# EAGLE design AmbientLight-2 (EAGLE 7.2.0)
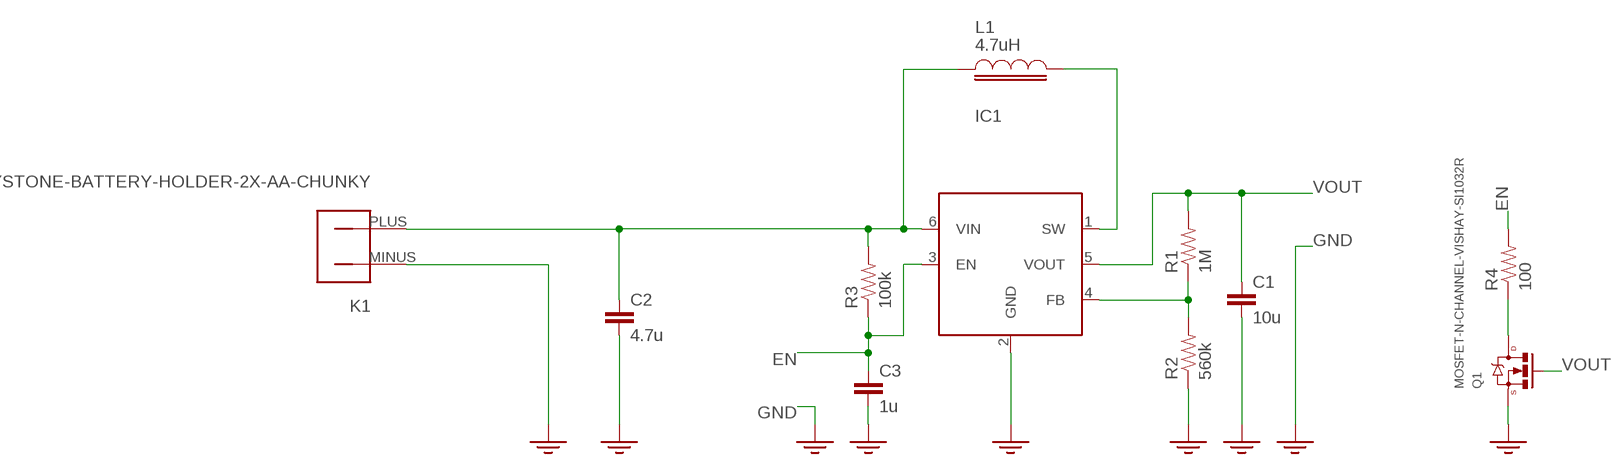
[diagram p0: schematic, sheet 1]

## Parts
C1  10u  CAP-0805-WIDE  [0805-WIDE]
C2  4.7u  CAP-0603-MIN  [0603-MIN]
C3  1u  CAP-0603-MIN  [0603-MIN]
IC1  SWITCHING-REGULATOR-VARIABLE-BOOST-MCP1640  [SOT23-6]
K1  KEYSTONE-BATTERY-HOLDER-2X-AA-CHUNKY  [KEYSTONE-BATTERY-HOLDER-2X-AA-CHUNKY]
L1  4.7uH  INDUCTOR-1210-MIN  [1210-INDUCTOR-MIN]
Q1  MOSFET-N-CHANNEL-VISHAY-SI1032R  [SC-75A]
R1  1M  RESISTOR-0603-MIN  [0603-MIN]
R2  560k  RESISTOR-0603-MIN  [0603-MIN]
R3  100k  RESISTOR-0603-MIN  [0603-MIN]
R4  100  RESISTOR-0603-MIN  [0603-MIN]

## Nets
EN: C3.2 IC1.3(EN) R3.1 R4.2
GND: C1.1 C2.1 C3.1 IC1.2(GND) K1.MINUS(PLUS) Q1.2(SOURCE) R2.1
N$1: Q1.3(DRAIN) R4.1
VBAT: C2.2 IC1.6(VIN) K1.PLUS(MINUS) L1.1 R3.2
VFB: IC1.4(FB) R1.1 R2.2
VOUT: C1.2 IC1.5(VOUT) Q1.1(GATE) R1.2
VSW: IC1.1(SW) L1.2

## Library data of the parts
C1-C3 = Outbreak:CAP
IC1 = Outbreak:SWITCHING-REGULATOR-VARIABLE-BOOST-MCP1640
K1 = Outbreak:KEYSTONE-BATTERY-HOLDER
L1 = Outbreak:INDUCTOR
Q1 = Outbreak:MOSFET-N-CHANNEL
R1-R4 = Outbreak:RESISTOR: Resistor Basic schematic elements and footprints for 0603, 1206, and PTH resistors.

## Board
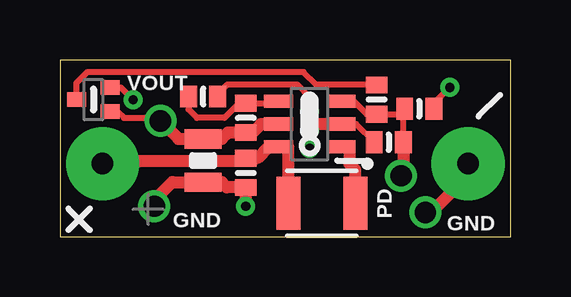
[diagram p1: board, top side]
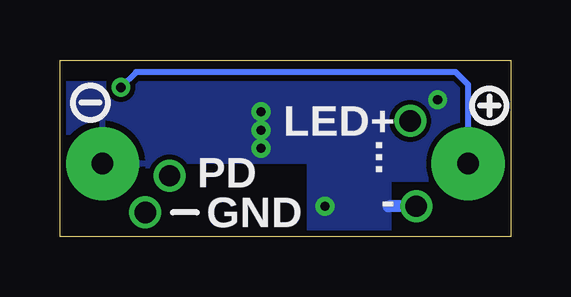
[diagram p2: board, bottom side, seen from below]

Size 18.8 x 7.37 mm. Coordinates in mm from the lower left corner, seen from the top.
Outline: 0,0 18.8,0 18.8,7.37 0,7.37 0,0
Copper layers (1*16): Top 0.035mm / dielectric 1.5mm / Bottom 0.035mm
Design rules "default *": minimum track width 10mil, minimum drill 24mil, track to track 8mil, track to pad 8mil, pad to pad 8mil, via to via 8mil, smd to smd 8mil, copper to edge 10mil, drill to drill 8mil, minimum pad ring 20mil, minimum via ring 8mil, stop-mask expansion 4mil, vias tented up to drill 20mil, thermal gap 10mil

### Footprints (pad centres in the part's own frame; a part is rotated, then mirrored left to right if it is on the bottom)
0805-WIDE = smd 0.8 x 1.524: 1 -0.9,0; 2 0.9,0
0603-MIN = smd 0.7 x 0.9: 1 -0.61,0; 2 0.61,0
SOT23-6 = smd 0.55 x 1.2: 1 0.95,1.3; 2 0,1.3; 3 -0.95,1.3; 4 -0.95,-1.3; 5 0,-1.3; 6 0.95,-1.3
KEYSTONE-BATTERY-HOLDER-2X-AA-CHUNKY = drill 0.9 pad 3.048: MINUS -7.62,0; PLUS 7.62,0
1210-INDUCTOR-MIN = smd 1 x 2.2: 1 -1.4,0; 2 1.4,0
SC-75A = smd 0.6 x 0.8: 1 0.5,0.7; 2 -0.5,0.7; 3 0,-0.7

### Placement (x,y rotation side)
C1  5.97,3.17 90 top
C2  7.75,2.67 90 top
C3  13.72,3.94 0 top
IC1  10.41,4.7 270 top
K1  9.4,3.05 180 top
L1  10.92,1.4 0 top
Q1  1.4,5.71 270 top
R1  7.75,4.95 270 top
R2  5.97,5.84 180 top
R3  14.99,5.33 0 top
R4  13.21,5.71 270 top

### Tracks (layer width: path | path; a pad name or v marks a point on that pad's centre or on a via)
EN  (via drill 0.89)
  Top 0.254: C3.2 14.33,5.28 R3.1 14.15,5.11 R4.2 12.8,5.11 12.26,5.65 IC1.3
  Top 0.508: C3.2 14.33,2.64 v14.22,2.54
GND  (via drill 0.38, 0.89)
  Top 0.254: IC1.2 12.34,4.7 C3.1 | R2.1 6.58,5.94 6.99,6.35 9.91,6.35 10.41,5.84 v10.41,5.21 | Q1.2 2.55,6.21 v3.05,5.71
  Top 0.508: 4.69,2.27 C1.1 6.74,2.27 6.96,2.06 C2.1 v7.75,1.27 | v10.41,4.45 v10.41,3.68 | IC1.2 10.41,4.7 v10.41,4.45 | v10.41,5.21 v10.41,4.45 | K1.MINUS 17.02,2.54 15.49,1.02 v15.24,1.02 | v3.94,1.27 3.94,1.52 4.7,2.29
  Bottom 0.508: v3.94,1.27 5.08,1.27
  pour Bottom: 0,6.35 18.8,6.35 18.8,2.54 13.46,2.54 13.46,3.17 8.38,3.17 8.38,0 5.08,0 5.08,2.41 0,2.41
N$1
  Top 0.254: R4.1 10.69,6.33 10.16,6.86 1.14,6.86 0.7,6.41 Q1.3
VBAT  (via drill 0.38)
  Top 0.254: R3.2 15.62,5.59 v16.26,6.22
  Top 0.508: L1.1 9.52,3.75 IC1.6 8.7,3.75 8.23,3.28 C2.2 7.52,3.17 1.91,3.17 K1.PLUS
  Bottom 0.254: v16.26,6.22 15.62,6.86 2.29,6.86 1.78,6.35 K1.PLUS
VFB
  Top 0.254: R1.1 9.03,5.56 IC1.4 | 7.64,5.59 R1.1 | R1.1 7.47,5.56 6.86,4.95 5.71,4.95 5.36,5.31 R2.2
VOUT  (via drill 0.89)
  Top 0.254: Q1.1 2.4,5.21 2.67,4.95 4.06,4.95 v4.19,4.83
  Top 0.508: IC1.5 8.38,4.7 8.03,4.34 R1.2 7.01,4.34 6.74,4.08 C1.2 4.94,4.08 v4.19,4.83
VSW
  Top 0.508: IC1.1 12.06,3.75 12.06,3.05 12.32,2.79 L1.2

### Text on the board
tPlace: VOUT | PD | GND | GND
bPlace: LED+ | ... | - | PD | GND
tDocu: https://docs.google.com/spreadsheets/d/1b9Oirg_7CsMoOT67FXmkAzQT9mrNKB5ivZXDMmT1TtM/edit#gid=0
tBuild: AmbientLight-2 | (C) 2015 Kuy Mainwaring | 1MΩ RES 0603 | 560kΩ RES 0603 | 100kΩ RES 0603 | CHIP | X | X | 1uF CAP 0603 | 10uF CAP 0805 | 4.7uH IND 1210 | 4.7uF CAP 0603